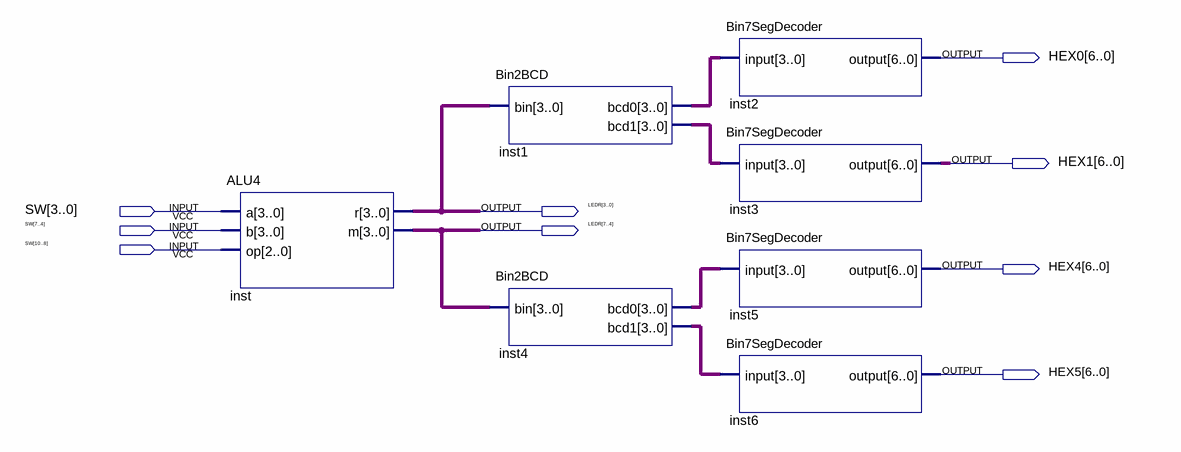
[diagram p0: schematic sheet]
// Quartus schematic ALUDemo.bdf as structural Verilog: 7 symbols, 9 pins
module ALUDemo (
  input  [10:0] SW,
  output [6:0] HEX0,
  output [6:0] HEX1,
  output [7:0] LEDR,
  output [6:0] HEX4,
  output [6:0] HEX5
);

  wire [3:0] inst1_bcd0, inst1_bcd1, inst4_bcd0, inst4_bcd1;

  ALU4 inst (.a(SW[3:0]), .b(SW[7:4]), .op(SW[10:8]), .r(LEDR[3:0]), .m(LEDR[7:4]));
  Bin2BCD inst1 (.bin(LEDR[3:0]), .bcd0(inst1_bcd0), .bcd1(inst1_bcd1));
  Bin2BCD inst4 (.bin(LEDR[7:4]), .bcd0(inst4_bcd0), .bcd1(inst4_bcd1));
  Bin7SegDecoder inst2 (.\input (inst1_bcd0), .\output (HEX0));
  Bin7SegDecoder inst3 (.\input (inst1_bcd1), .\output (HEX1));
  Bin7SegDecoder inst5 (.\input (inst4_bcd0), .\output (HEX4));
  Bin7SegDecoder inst6 (.\input (inst4_bcd1), .\output (HEX5));
endmodule
